# Altium schematic sheet DW1000.SchDoc
size A; SheetNumber: 6
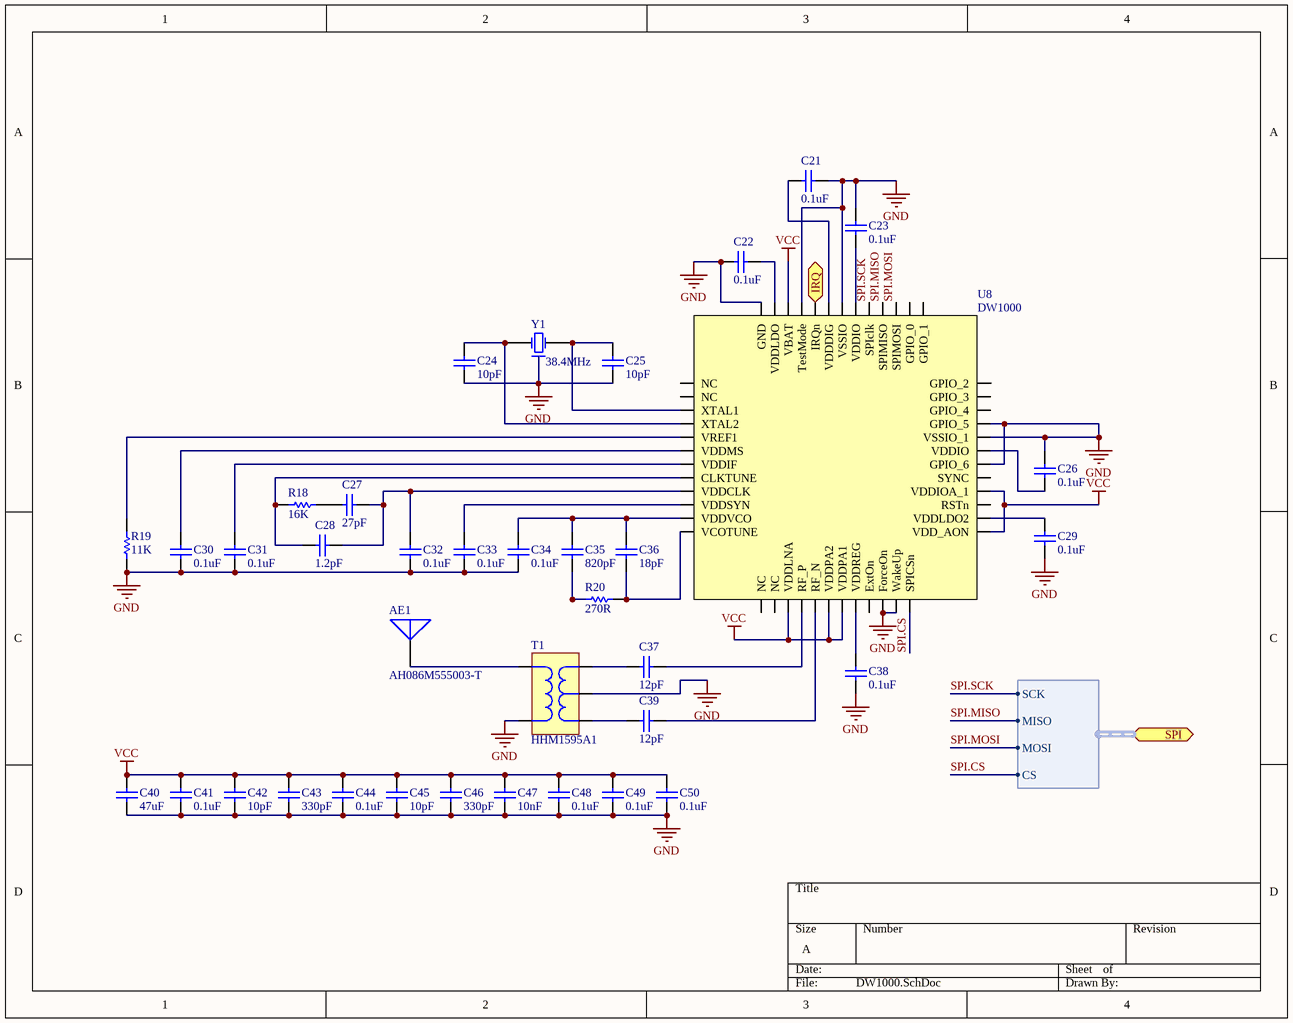
[diagram p0: DW1000.SchDoc]

## Parts
AE1  AH086M555003-T  [AH086M555003-T]
C21  value 0.1uF  [C0402[1005X55]]  (hidden comment: 0.1uF 6.3V 0402)
C22  value 0.1uF  [C0402[1005X55]]  (hidden comment: 0.1uF 6.3V 0402)
C23  value 0.1uF  [C0402[1005X55]]  (hidden comment: 0.1uF 6.3V 0402)
C24  value 10pF  [C0402[1005X55]]  (hidden comment: 10pF 50V 0402)
C25  value 10pF  [C0402[1005X55]]  (hidden comment: 10pF 50V 0402)
C26  value 0.1uF  [C0402[1005X55]]  (hidden comment: 0.1uF 6.3V 0402)
C27  value 27pF  [C0402[1005X55]]  (hidden comment: 27pF 50V 0402)
C28  value 1.2pF  [C0402[1005X55]]  (hidden comment: 1.2pF 50V 0402)
C29  value 0.1uF  [C0402[1005X55]]  (hidden comment: 0.1uF 6.3V 0402)
C30  value 0.1uF  [C0402[1005X55]]  (hidden comment: 0.1uF 6.3V 0402)
C31  value 0.1uF  [C0402[1005X55]]  (hidden comment: 0.1uF 6.3V 0402)
C32  value 0.1uF  [C0402[1005X55]]  (hidden comment: 0.1uF 6.3V 0402)
C33  value 0.1uF  [C0402[1005X55]]  (hidden comment: 0.1uF 6.3V 0402)
C34  value 0.1uF  [C0402[1005X55]]  (hidden comment: 0.1uF 6.3V 0402)
C35  value 820pF  [C0402[1005X55]]  (hidden comment: 820pF 50V 0402)
C36  value 18pF  [C0402[1005X55]]  (hidden comment: 18pF 50V 0402)
C37  value 12pF  [C0402[1005X55]]  (hidden comment: 12pF 50V 0402)
C38  value 0.1uF  [C0402[1005X55]]  (hidden comment: 0.1uF 6.3V 0402)
C39  value 12pF  [C0402[1005X55]]  (hidden comment: 12pF 50V 0402)
C40  value 47uF  [C1206[3216X160]]  (hidden comment: 47uF 6.3V 1206)
C41  value 0.1uF  [C0402[1005X55]]  (hidden comment: 0.1uF 6.3V 0402)
C42  value 10pF  [C0402[1005X55]]  (hidden comment: 10pF 50V 0402)
C43  value 330pF  [C0402[1005X55]]  (hidden comment: 330pF 50V 0402)
C44  value 0.1uF  [C0402[1005X55]]  (hidden comment: 0.1uF 6.3V 0402)
C45  value 10pF  [C0402[1005X55]]  (hidden comment: 10pF 50V 0402)
C46  value 330pF  [C0402[1005X55]]  (hidden comment: 330pF 50V 0402)
C47  value 10nF  [C0402[1005X55]]  (hidden comment: 10nF 50V 0402)
C48  value 0.1uF  [C0402[1005X55]]  (hidden comment: 0.1uF 6.3V 0402)
C49  value 0.1uF  [C0402[1005X55]]  (hidden comment: 0.1uF 6.3V 0402)
C50  value 0.1uF  [C0402[1005X55]]  (hidden comment: 0.1uF 6.3V 0402)
R18  value 16K  [R0402[1005]]  (hidden comment: 16K 1% 0402)
R19  value 11K  [R0402[1005]]  (hidden comment: 11K 1% 0402)
R20  value 270R  [R0402[1005]]  (hidden comment: 270R 1% 0402)
T1  HHM1595A1  [HHM1595A1]
U8  DW1000  [QFN-48]
Y1  38.4MHz  [ABRA-ABM10]

## Ports
IRQ (out), SPI (harness SPI)

## Harnesses
SPI: SCK, MISO, MOSI, CS

## Nets
GND: C21.1 C22.2 C23.2 C24.1 C25.1 C26.2 C29.1 C30.1 C31.1 C32.1 C33.1 C34.1 C38.1 C40.1 C41.1 C42.1 C43.1 C44.1 C45.1 C46.1 C47.1 C48.1 C49.1 C50.1 R19.1 T1.2 T1.5 U8.22(ForceOn) U8.23(WakeUp) U8.30(GPIO_6) U8.32(VSSIO_1) U8.33(GPIO_5) U8.43(VSSIO) U8.46(TestMode) U8.49(GND) Y1.2
VCC: C40.2 C41.2 C42.2 C43.2 C44.2 C45.2 C46.2 C47.2 C48.2 C49.2 C50.2 U8.15(VDDLNA) U8.18(VDDPA2) U8.19(VDDPA1) U8.25(VDD_AON) U8.28(VDDIOA_1) U8.47(VBAT)
IRQ: U8.45(IRQn) ; port IRQ
SPI.CS: U8.24(SPICSn) ; port SPI.CS
SPI.MISO: U8.40(SPIMISO) ; port SPI.MISO
SPI.MOSI: U8.39(SPIMOSI) ; port SPI.MOSI
SPI.SCK: U8.41(SPIclk) ; port SPI.SCK
NetAE1_1: AE1.1 T1.1
NetC21_2: C21.2 U8.44(VDDDIG)
NetC22_1: C22.1 U8.48(VDDLDO)
NetC23_1: C23.1 U8.42(VDDIO)
NetC24_2: C24.2 U8.4(XTAL2) Y1.1(X1)
NetC25_2: C25.2 U8.3(XTAL1) Y1.3(X2)
NetC26_1: C26.1 U8.31(VDDIO)
NetC27_1: C27.1 C28.1 C32.2 U8.9(VDDCLK)
NetC27_2: C27.2 R18.1
NetC28_2: C28.2 R18.2 U8.8(CLKTUNE)
NetC29_2: C29.2 U8.26(VDDLDO2)
NetC30_2: C30.2 U8.6(VDDMS)
NetC31_2: C31.2 U8.7(VDDIF)
NetC33_2: C33.2 U8.10(VDDSYN)
NetC34_2: C34.2 C35.2 C36.2 U8.11(VDDVCO)
NetC35_1: C35.1 R20.1
NetC36_1: C36.1 R20.2 U8.12(VCOTUNE)
NetC37_1: C37.1 T1.4
NetC37_2: C37.2 U8.16(RF_P)
NetC38_2: C38.2 U8.20(VDDREG)
NetC39_1: C39.1 T1.3
NetC39_2: C39.2 U8.17(RF_N)
NetR19_2: R19.2 U8.5(VREF1)

Not connected (* = marked no-connect by the designer): U8 1(NC) 2(NC) 13(NC) 14(NC) 21(ExtOn) 27(RSTn) 29(SYNC) 34(GPIO_4) 35(GPIO_3) 36(GPIO_2) 37(GPIO_1) 38(GPIO_0)

## Library data of the parts
AE1 = AH086M555003-T: Manufacturer: Taiyo Yuden; PartNumber: AH086M555003-T; Mounting Technology: Surface Mount
C21-C23 C26 C29-C34 C38 C41 C44 C48-C50 = CAP_0.1uF_6.3V_0402_10%: 0.1uF 6.3V 10% 0402 (1005 Metric); PartNumber: GRM155R70J104KA01D; Manufacturer: Murata; Mounting Technology: Surface Mount; PackageReference: 0402; PackageDescription: 0402 (1005 Metric); Voltage: 6.3V; Tolerance: 10%
C24 C25 C42 C45 = CAP_10pF_50V_0402_1%: 10pF 50V 1% 0402 (1005 Metric); PartNumber: GRM1555C1H100FA01D; Manufacturer: Murata; Mounting Technology: Surface Mount; PackageReference: 0402; PackageDescription: 0402 (1005 Metric); Voltage: 50V; Tolerance: 1%
C27 = CAP_27pF_50V_0402_1%: 27pF 50V 1% 0402 (1005 Metric); PartNumber: GRM1555C1H270FA01D; Manufacturer: Murata; Mounting Technology: Surface Mount; PackageReference: 0402; PackageDescription: 0402 (1005 Metric); Voltage: 50V; Tolerance: 1%
C28 = CAP_1.2pF_50V_0402_0.05pF: 1.2pF 50V 0.05pF 0402 (1005 Metric); PartNumber: GRM1555C1H1R2WA01D; Manufacturer: Murata; Mounting Technology: Surface Mount; PackageReference: 0402; PackageDescription: 0402 (1005 Metric); Voltage: 50V; Tolerance: 0.05pF
C35 = CAP_820pF_50V_0402_5%: 820pF 50V 5% 0402 (1005 Metric); PartNumber: GRM1555C1H821JA01D; Manufacturer: Murata; Mounting Technology: Surface Mount; PackageReference: 0402; PackageDescription: 0402 (1005 Metric); Voltage: 50V; Tolerance: 5%
C36 = CAP_18pF_50V_0402_1%: 18pF 50V 1% 0402 (1005 Metric); PartNumber: GRM1555C1H180FA01D; Manufacturer: Murata; Mounting Technology: Surface Mount; PackageReference: 0402; PackageDescription: 0402 (1005 Metric); Voltage: 50V; Tolerance: 1%
C37 C39 = CAP_12pF_50V_0402_5%: 12pF 50V 5% 0402 (1005 Metric); PartNumber: GRM1555C1H120JA01D; Manufacturer: Murata; Mounting Technology: Surface Mount; PackageReference: 0402; PackageDescription: 0402 (1005 Metric); Voltage: 50V; Tolerance: 5%
C40 = CAP_47uF_6.3V_1206_10%: 47uF 6.3V 10% 1206 (3216 Metric); PartNumber: GRM31CR60J476KE19L; Manufacturer: Murata; Mounting Technology: Surface Mount; PackageReference: 1206; PackageDescription: 1206 (3216 Metric); Voltage: 6.3V; Tolerance: 10%
C43 C46 = CAP_330pF_50V_0402_5%: 330pF 50V 5% 0402 (1005 Metric); PartNumber: GRM1555C1H331JA01D; Manufacturer: Murata; Mounting Technology: Surface Mount; PackageReference: 0402; PackageDescription: 0402 (1005 Metric); Voltage: 50V; Tolerance: 5%
C47 = CAP_10nF_50V_0402_10%: 10nF 50V 10% 0402 (1005 Metric); PartNumber: GCM155R71H103KA55D; Manufacturer: Murata; Mounting Technology: Surface Mount; PackageReference: 0402; PackageDescription: 0402 (1005 Metric); Voltage: 50V; Tolerance: 10%
R18 = RES_16K_0402_1%: 16K 0.063W 1% 0402 (1005 Metric); Manufacturer: KOA Speer; PartNumber: RK73H1ETTP1602F; Tolerance: 1%; Power: 0.063W; Mounting Technology: Surface Mount; PackageReference: 0402; PackageDescription: 0402 (1005 Metric); ComponentLink1Description: Datasheet; ComponentLink1URL: http://www.koaspeer.com/catimages/Products/RK73H/RK73H.pdf
R19 = RES_11K_0402_1%: 11K 0.063W 1% 0402 (1005 Metric); Manufacturer: KOA Speer; PartNumber: RK73H1ETTP1102F; Tolerance: 1%; Power: 0.063W; Mounting Technology: Surface Mount; PackageReference: 0402; PackageDescription: 0402 (1005 Metric); ComponentLink1Description: Datasheet; ComponentLink1URL: http://www.koaspeer.com/catimages/Products/RK73H/RK73H.pdf
R20 = RES_270R_0402_1%: 270R 0.063W 1% 0402 (1005 Metric); Manufacturer: KOA Speer; PartNumber: RK73H1ETTP2700F; Tolerance: 1%; Power: 0.063W; Mounting Technology: Surface Mount; PackageReference: 0402; PackageDescription: 0402 (1005 Metric); ComponentLink1Description: Datasheet; ComponentLink1URL: http://www.koaspeer.com/catimages/Products/RK73H/RK73H.pdf
T1 = HHM1595A1: Manufacturer: TDK; PartNumber: HHM1595A1; PackageReference: 0805; Mounting Technology: Surface Mount
U8 = DW1000: UWB DW1000; Part Number: DW1000-I-TR13; Manufacturer: Decawave Limited; PackageReference: QFN-48; Mounting Technology: Surface Mount
Y1 = ABM10-165-38.400MHZ-T3: Manufacturer: ABRACON; PartNumber: ABM10-165-38.400MHZ-T3; Mounting Technology: Surface Mount; PackageReference: 4-SMD; PackageDescription: 4-SMD, No Lead (DFN, LCC)